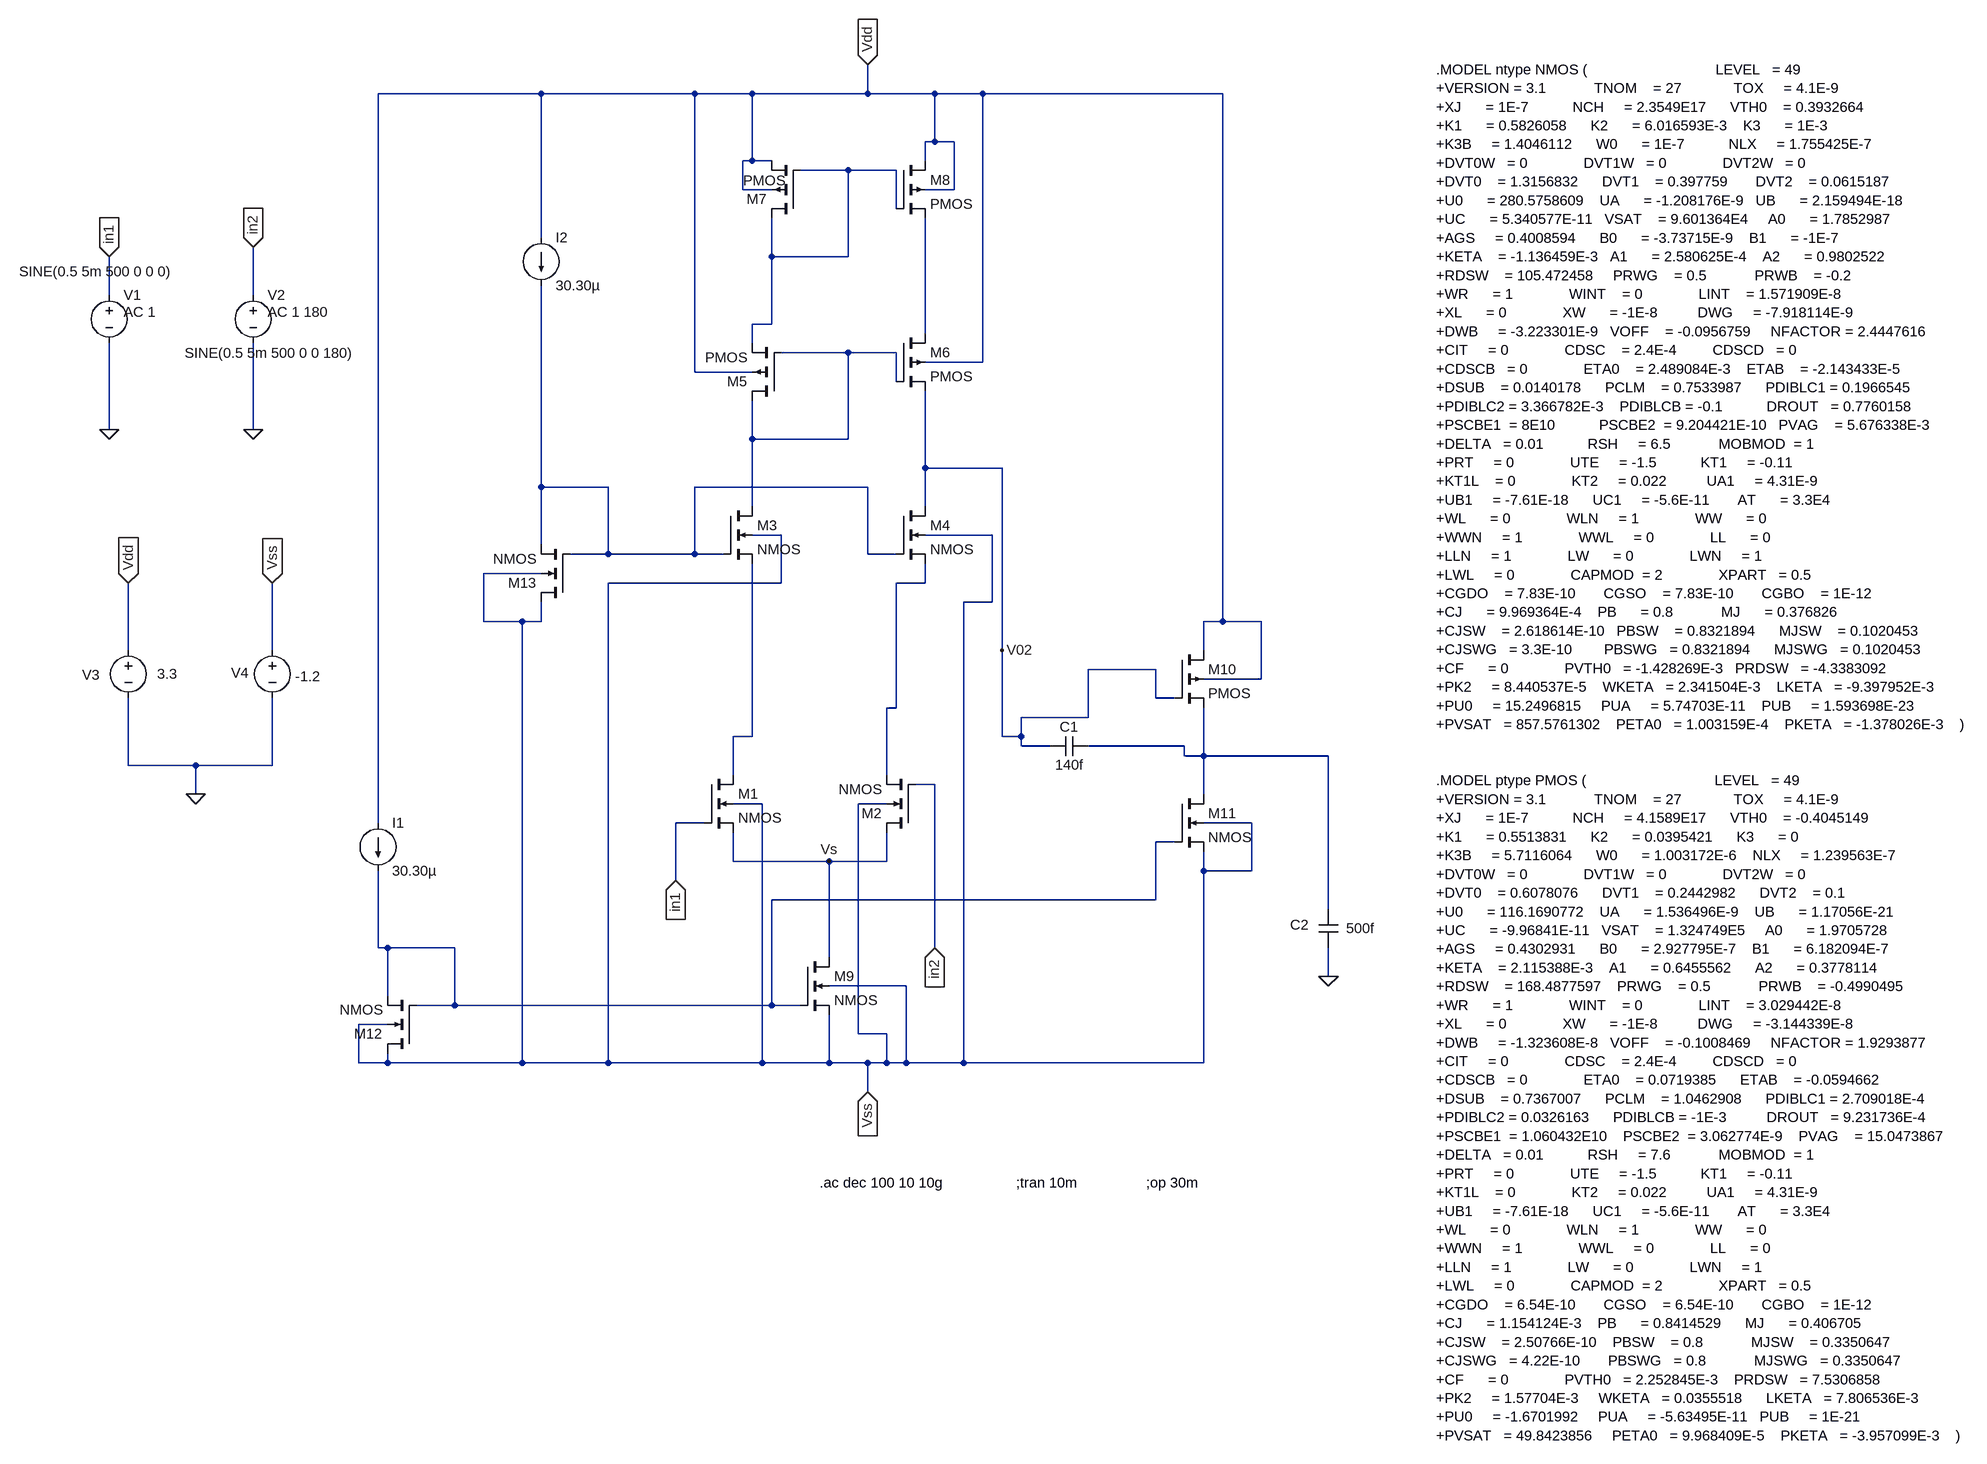
[diagram p0: schematic ##2 stage telescopic opamp (2).asc]
##2 stage telescopic opamp (2).asc, the LTspice schematic file:
Version 4
SHEET 1 2396 1624
WIRE -224 -672 -496 -672
WIRE 32 -672 -224 -672
WIRE 128 -672 32 -672
WIRE 320 -672 320 -720
WIRE 320 -672 128 -672
WIRE 432 -672 320 -672
WIRE 512 -672 432 -672
WIRE 912 -672 512 -672
WIRE 432 -592 432 -672
WIRE 432 -592 416 -592
WIRE 464 -592 432 -592
WIRE 128 -560 128 -672
WIRE 128 -560 112 -560
WIRE 160 -560 128 -560
WIRE 416 -560 416 -592
WIRE 288 -544 208 -544
WIRE 368 -544 288 -544
WIRE 112 -512 112 -560
WIRE 160 -512 112 -512
WIRE 464 -512 464 -592
WIRE 464 -512 416 -512
WIRE 368 -480 368 -544
WIRE -224 -432 -224 -672
WIRE 160 -400 160 -464
WIRE 288 -400 288 -544
WIRE 288 -400 160 -400
WIRE -944 -336 -944 -400
WIRE -704 -336 -704 -416
WIRE 160 -288 160 -400
WIRE 160 -288 128 -288
WIRE 416 -272 416 -464
WIRE 128 -256 128 -288
WIRE 288 -240 176 -240
WIRE 368 -240 288 -240
WIRE 512 -224 512 -672
WIRE 512 -224 416 -224
WIRE 32 -208 32 -672
WIRE 128 -208 32 -208
WIRE 368 -192 368 -240
WIRE -944 -112 -944 -256
WIRE -704 -112 -704 -256
WIRE 128 -96 128 -160
WIRE 288 -96 288 -240
WIRE 288 -96 128 -96
WIRE 416 -48 416 -176
WIRE 544 -48 416 -48
WIRE -224 -16 -224 -352
WIRE -112 -16 -224 -16
WIRE 320 -16 32 -16
WIRE 128 16 128 -96
WIRE 416 16 416 -48
WIRE 176 64 128 64
WIRE 528 64 416 64
WIRE -224 80 -224 -16
WIRE -112 96 -112 -16
WIRE -112 96 -176 96
WIRE 32 96 32 -16
WIRE 32 96 -112 96
WIRE 80 96 32 96
WIRE 320 96 320 -16
WIRE 368 96 320 96
WIRE -224 128 -320 128
WIRE 176 144 176 64
WIRE 176 144 -112 144
WIRE 416 144 416 112
WIRE 416 144 368 144
WIRE 528 176 528 64
WIRE 528 176 480 176
WIRE -320 208 -320 128
WIRE -256 208 -320 208
WIRE -224 208 -224 176
WIRE -224 208 -256 208
WIRE 912 208 912 -672
WIRE 912 208 880 208
WIRE 976 208 912 208
WIRE -912 256 -912 144
WIRE -672 256 -672 144
WIRE 544 256 544 -48
WIRE 880 256 880 208
WIRE 800 288 688 288
WIRE 976 304 976 208
WIRE 976 304 880 304
WIRE 800 336 800 288
WIRE 832 336 800 336
WIRE 368 352 368 144
WIRE 368 352 352 352
WIRE 688 368 688 288
WIRE 688 368 576 368
WIRE 128 400 128 112
WIRE 128 400 96 400
WIRE 544 400 544 256
WIRE 576 400 576 368
WIRE 576 400 544 400
WIRE 576 416 576 400
WIRE 624 416 576 416
WIRE 848 416 688 416
WIRE 848 432 848 416
WIRE 880 432 880 352
WIRE 880 432 848 432
WIRE 1088 432 880 432
WIRE -912 448 -912 336
WIRE -800 448 -912 448
WIRE -672 448 -672 336
WIRE -672 448 -800 448
WIRE 96 464 96 400
WIRE 352 464 352 352
WIRE 432 480 400 480
WIRE -800 496 -800 448
WIRE 880 496 880 432
WIRE 144 512 96 512
WIRE 352 512 304 512
WIRE -496 544 -496 -672
WIRE 48 544 0 544
WIRE 960 544 880 544
WIRE 832 576 800 576
WIRE 96 608 96 560
WIRE 256 608 96 608
WIRE 352 608 352 560
WIRE 352 608 256 608
WIRE 880 624 880 592
WIRE 960 624 960 544
WIRE 960 624 880 624
WIRE 0 640 0 544
WIRE 800 672 800 576
WIRE 800 672 160 672
WIRE 1088 688 1088 432
WIRE -496 752 -496 624
WIRE -480 752 -496 752
WIRE -368 752 -480 752
WIRE 432 752 432 480
WIRE 256 768 256 608
WIRE 1088 800 1088 752
WIRE 384 816 256 816
WIRE -480 832 -480 752
WIRE -368 848 -368 752
WIRE -368 848 -432 848
WIRE 160 848 160 672
WIRE 160 848 -368 848
WIRE 208 848 160 848
WIRE -480 880 -528 880
WIRE 304 896 304 512
WIRE 352 896 304 896
WIRE -528 944 -528 880
WIRE -480 944 -480 928
WIRE -480 944 -528 944
WIRE -256 944 -256 208
WIRE -256 944 -480 944
WIRE -112 944 -112 144
WIRE -112 944 -256 944
WIRE 144 944 144 512
WIRE 144 944 -112 944
WIRE 256 944 256 864
WIRE 256 944 144 944
WIRE 320 944 256 944
WIRE 352 944 352 896
WIRE 352 944 320 944
WIRE 384 944 384 816
WIRE 384 944 352 944
WIRE 480 944 480 176
WIRE 480 944 384 944
WIRE 880 944 880 624
WIRE 880 944 480 944
WIRE 320 992 320 944
FLAG 1088 800 0
FLAG -800 496 0
FLAG 256 608 Vs
FLAG -944 -112 0
FLAG -944 -400 in1
IOPIN -944 -400 In
FLAG 0 640 in1
IOPIN 0 640 In
FLAG 432 752 in2
IOPIN 432 752 In
FLAG -704 -112 0
FLAG -704 -416 in2
IOPIN -704 -416 In
FLAG 544 256 V02
FLAG -912 144 Vdd
IOPIN -912 144 In
FLAG -672 144 Vss
IOPIN -672 144 In
FLAG 320 -720 Vdd
IOPIN 320 -720 In
FLAG 320 992 Vss
IOPIN 320 992 In
SYMBOL nmos4 48 464 R0
SYMATTR InstName M1
SYMATTR Value2 l=180n w=0.745u
SYMBOL nmos4 208 768 R0
SYMATTR InstName M9
SYMATTR Value2 l=180n w=1490n
SYMBOL nmos4 -432 928 R180
SYMATTR InstName M12
SYMATTR Value2 l=180n w=50n
SYMBOL nmos4 400 560 R180
SYMATTR InstName M2
SYMATTR Value2 l=180n w=0.745u
SYMBOL nmos4 832 496 R0
SYMATTR InstName M11
SYMATTR Value2 l=180n w=10.2138u
SYMBOL pmos4 368 -560 R0
SYMATTR InstName M8
SYMATTR Value2 l=180n w=0.643u
SYMBOL pmos4 208 -464 R180
WINDOW 3 25 63 Left 2
SYMATTR InstName M7
SYMATTR Value2 l=180n w=0.643u
SYMBOL cap 688 400 R90
WINDOW 0 0 32 VBottom 2
WINDOW 3 32 32 VTop 2
SYMATTR InstName C1
SYMATTR Value 140f
SYMBOL cap 1104 752 R180
WINDOW 0 49 38 Left 2
WINDOW 3 -61 32 Left 2
SYMATTR InstName C2
SYMATTR Value 500f
SYMBOL pmos4 832 256 R0
SYMATTR InstName M10
SYMATTR Value2 l=180n w=16.248u
SYMBOL current -496 544 R0
WINDOW 123 0 0 Left 0
WINDOW 39 0 0 Left 0
SYMATTR InstName I1
SYMATTR Value 30.30µ
SYMBOL voltage -912 240 R0
WINDOW 123 0 0 Left 0
WINDOW 39 0 0 Left 0
WINDOW 0 -77 57 Left 2
WINDOW 3 48 56 Left 2
SYMATTR InstName V3
SYMATTR Value 3.3
SYMBOL voltage -672 240 R0
WINDOW 123 0 0 Left 0
WINDOW 39 0 0 Left 0
WINDOW 0 -69 54 Left 2
WINDOW 3 38 60 Left 2
SYMATTR InstName V4
SYMATTR Value -1.2
SYMBOL pmos4 176 -160 R180
SYMATTR InstName M5
SYMATTR Value2 l=180n w=0.643u
SYMBOL pmos4 368 -272 R0
SYMATTR InstName M6
SYMATTR Value2 l=180n w=0.643u
SYMBOL nmos4 80 16 R0
SYMATTR InstName M3
SYMATTR Value2 l=180n w=0.331u
SYMBOL nmos4 368 16 R0
SYMATTR InstName M4
SYMATTR Value2 l=180n w=0.331u
SYMBOL nmos4 -176 176 R180
SYMATTR InstName M13
SYMATTR Value2 l=180n w=116n
SYMBOL current -224 -432 R0
SYMATTR InstName I2
SYMATTR Value 30.30µ
SYMBOL voltage -944 -352 R0
WINDOW 3 -150 -23 Left 2
WINDOW 123 24 44 Left 2
WINDOW 39 0 0 Left 0
SYMATTR Value SINE(0.5 5m 500 0 0 0)
SYMATTR Value2 AC 1
SYMATTR InstName V1
SYMBOL voltage -704 -352 R0
WINDOW 3 -114 113 Left 2
WINDOW 123 24 44 Left 2
WINDOW 39 0 0 Left 0
SYMATTR Value SINE(0.5 5m 500 0 0 180)
SYMATTR Value2 AC 1 180
SYMATTR InstName V2
TEXT 1456 -712 Left 2 !.MODEL ntype NMOS (                                LEVEL   = 49\n+VERSION = 3.1            TNOM    = 27             TOX     = 4.1E-9\n+XJ      = 1E-7           NCH     = 2.3549E17      VTH0    = 0.3932664\n+K1      = 0.5826058      K2      = 6.016593E-3    K3      = 1E-3\n+K3B     = 1.4046112      W0      = 1E-7           NLX     = 1.755425E-7\n+DVT0W   = 0              DVT1W   = 0              DVT2W   = 0\n+DVT0    = 1.3156832      DVT1    = 0.397759       DVT2    = 0.0615187\n+U0      = 280.5758609    UA      = -1.208176E-9   UB      = 2.159494E-18\n+UC      = 5.340577E-11   VSAT    = 9.601364E4     A0      = 1.7852987\n+AGS     = 0.4008594      B0      = -3.73715E-9    B1      = -1E-7\n+KETA    = -1.136459E-3   A1      = 2.580625E-4    A2      = 0.9802522\n+RDSW    = 105.472458     PRWG    = 0.5            PRWB    = -0.2\n+WR      = 1              WINT    = 0              LINT    = 1.571909E-8\n+XL      = 0              XW      = -1E-8          DWG     = -7.918114E-9\n+DWB     = -3.223301E-9   VOFF    = -0.0956759     NFACTOR = 2.4447616\n+CIT     = 0              CDSC    = 2.4E-4         CDSCD   = 0\n+CDSCB   = 0              ETA0    = 2.489084E-3    ETAB    = -2.143433E-5\n+DSUB    = 0.0140178      PCLM    = 0.7533987      PDIBLC1 = 0.1966545\n+PDIBLC2 = 3.366782E-3    PDIBLCB = -0.1           DROUT   = 0.7760158\n+PSCBE1  = 8E10           PSCBE2  = 9.204421E-10   PVAG    = 5.676338E-3\n+DELTA   = 0.01           RSH     = 6.5            MOBMOD  = 1\n+PRT     = 0              UTE     = -1.5           KT1     = -0.11\n+KT1L    = 0              KT2     = 0.022          UA1     = 4.31E-9\n+UB1     = -7.61E-18      UC1     = -5.6E-11       AT      = 3.3E4\n+WL      = 0              WLN     = 1              WW      = 0\n+WWN     = 1              WWL     = 0              LL      = 0\n+LLN     = 1              LW      = 0              LWN     = 1\n+LWL     = 0              CAPMOD  = 2              XPART   = 0.5\n+CGDO    = 7.83E-10       CGSO    = 7.83E-10       CGBO    = 1E-12\n+CJ      = 9.969364E-4    PB      = 0.8            MJ      = 0.376826\n+CJSW    = 2.618614E-10   PBSW    = 0.8321894      MJSW    = 0.1020453\n+CJSWG   = 3.3E-10        PBSWG   = 0.8321894      MJSWG   = 0.1020453\n+CF      = 0              PVTH0   = -1.428269E-3   PRDSW   = -4.3383092\n+PK2     = 8.440537E-5    WKETA   = 2.341504E-3    LKETA   = -9.397952E-3\n+PU0     = 15.2496815     PUA     = 5.74703E-11    PUB     = 1.593698E-23\n+PVSAT   = 857.5761302    PETA0   = 1.003159E-4    PKETA   = -1.378026E-3    )\n \n\n.MODEL ptype PMOS (                                LEVEL   = 49\n+VERSION = 3.1            TNOM    = 27             TOX     = 4.1E-9\n+XJ      = 1E-7           NCH     = 4.1589E17      VTH0    = -0.4045149\n+K1      = 0.5513831      K2      = 0.0395421      K3      = 0\n+K3B     = 5.7116064      W0      = 1.003172E-6    NLX     = 1.239563E-7\n+DVT0W   = 0              DVT1W   = 0              DVT2W   = 0\n+DVT0    = 0.6078076      DVT1    = 0.2442982      DVT2    = 0.1\n+U0      = 116.1690772    UA      = 1.536496E-9    UB      = 1.17056E-21\n+UC      = -9.96841E-11   VSAT    = 1.324749E5     A0      = 1.9705728\n+AGS     = 0.4302931      B0      = 2.927795E-7    B1      = 6.182094E-7\n+KETA    = 2.115388E-3    A1      = 0.6455562      A2      = 0.3778114\n+RDSW    = 168.4877597    PRWG    = 0.5            PRWB    = -0.4990495\n+WR      = 1              WINT    = 0              LINT    = 3.029442E-8\n+XL      = 0              XW      = -1E-8          DWG     = -3.144339E-8\n+DWB     = -1.323608E-8   VOFF    = -0.1008469     NFACTOR = 1.9293877\n+CIT     = 0              CDSC    = 2.4E-4         CDSCD   = 0\n+CDSCB   = 0              ETA0    = 0.0719385      ETAB    = -0.0594662\n+DSUB    = 0.7367007      PCLM    = 1.0462908      PDIBLC1 = 2.709018E-4\n+PDIBLC2 = 0.0326163      PDIBLCB = -1E-3          DROUT   = 9.231736E-4\n+PSCBE1  = 1.060432E10    PSCBE2  = 3.062774E-9    PVAG    = 15.0473867\n+DELTA   = 0.01           RSH     = 7.6            MOBMOD  = 1\n+PRT     = 0              UTE     = -1.5           KT1     = -0.11\n+KT1L    = 0              KT2     = 0.022          UA1     = 4.31E-9\n+UB1     = -7.61E-18      UC1     = -5.6E-11       AT      = 3.3E4\n+WL      = 0              WLN     = 1              WW      = 0\n+WWN     = 1              WWL     = 0              LL      = 0\n+LLN     = 1              LW      = 0              LWN     = 1\n+LWL     = 0              CAPMOD  = 2              XPART   = 0.5\n+CGDO    = 6.54E-10       CGSO    = 6.54E-10       CGBO    = 1E-12\n+CJ      = 1.154124E-3    PB      = 0.8414529      MJ      = 0.406705\n+CJSW    = 2.50766E-10    PBSW    = 0.8            MJSW    = 0.3350647\n+CJSWG   = 4.22E-10       PBSWG   = 0.8            MJSWG   = 0.3350647\n+CF      = 0              PVTH0   = 2.252845E-3    PRDSW   = 7.5306858\n+PK2     = 1.57704E-3     WKETA   = 0.0355518      LKETA   = 7.806536E-3\n+PU0     = -1.6701992     PUA     = -5.63495E-11   PUB     = 1E-21\n+PVSAT   = 49.8423856     PETA0   = 9.968409E-5    PKETA   = -3.957099E-3    )
TEXT 240 1144 Left 2 !.ac dec 100 10 10g
TEXT 568 1144 Left 2 !;tran 10m
TEXT 784 1144 Left 2 !;op 30m

The netlist it stands for:
* ##2 stage telescopic opamp (2).asc
M1 N006 in1 Vs Vss NMOS l=180n w=0.745u
M9 Vs N008 Vss Vss NMOS l=180n w=1490n
M12 Vss N008 N008 Vss NMOS l=180n w=50n
M2 Vs in2 N005 Vss NMOS l=180n w=0.745u
M11 N007 N008 Vss Vss NMOS l=180n w=10.2138u
M8 Vdd N001 N002 Vdd PMOS l=180n w=0.643u
M7 N001 N001 Vdd Vdd PMOS l=180n w=0.643u
C1 N007 V02 140f
C2 0 N007 500f
M10 Vdd V02 N007 Vdd PMOS l=180n w=16.248u
I1 Vdd N008 30.30µ
V3 Vdd 0 3.3
V4 Vss 0 -1.2
M5 N003 N003 N001 Vdd PMOS l=180n w=0.643u
M6 N002 N003 V02 Vdd PMOS l=180n w=0.643u
M3 N003 N004 N006 Vss NMOS l=180n w=0.331u
M4 V02 N004 N005 Vss NMOS l=180n w=0.331u
M13 Vss N004 N004 Vss NMOS l=180n w=116n
I2 Vdd N004 30.30µ
V1 in1 0 SINE(0.5 5m 500 0 0 0) AC 1
V2 in2 0 SINE(0.5 5m 500 0 0 180) AC 1 180
.model NMOS NMOS
.model PMOS PMOS
.lib standard.mos
.MODEL ntype NMOS (                                LEVEL   = 49
+VERSION = 3.1            TNOM    = 27             TOX     = 4.1E-9
+XJ      = 1E-7           NCH     = 2.3549E17      VTH0    = 0.3932664
+K1      = 0.5826058      K2      = 6.016593E-3    K3      = 1E-3
+K3B     = 1.4046112      W0      = 1E-7           NLX     = 1.755425E-7
+DVT0W   = 0              DVT1W   = 0              DVT2W   = 0
+DVT0    = 1.3156832      DVT1    = 0.397759       DVT2    = 0.0615187
+U0      = 280.5758609    UA      = -1.208176E-9   UB      = 2.159494E-18
+UC      = 5.340577E-11   VSAT    = 9.601364E4     A0      = 1.7852987
+AGS     = 0.4008594      B0      = -3.73715E-9    B1      = -1E-7
+KETA    = -1.136459E-3   A1      = 2.580625E-4    A2      = 0.9802522
+RDSW    = 105.472458     PRWG    = 0.5            PRWB    = -0.2
+WR      = 1              WINT    = 0              LINT    = 1.571909E-8
+XL      = 0              XW      = -1E-8          DWG     = -7.918114E-9
+DWB     = -3.223301E-9   VOFF    = -0.0956759     NFACTOR = 2.4447616
+CIT     = 0              CDSC    = 2.4E-4         CDSCD   = 0
+CDSCB   = 0              ETA0    = 2.489084E-3    ETAB    = -2.143433E-5
+DSUB    = 0.0140178      PCLM    = 0.7533987      PDIBLC1 = 0.1966545
+PDIBLC2 = 3.366782E-3    PDIBLCB = -0.1           DROUT   = 0.7760158
+PSCBE1  = 8E10           PSCBE2  = 9.204421E-10   PVAG    = 5.676338E-3
+DELTA   = 0.01           RSH     = 6.5            MOBMOD  = 1
+PRT     = 0              UTE     = -1.5           KT1     = -0.11
+KT1L    = 0              KT2     = 0.022          UA1     = 4.31E-9
+UB1     = -7.61E-18      UC1     = -5.6E-11       AT      = 3.3E4
+WL      = 0              WLN     = 1              WW      = 0
+WWN     = 1              WWL     = 0              LL      = 0
+LLN     = 1              LW      = 0              LWN     = 1
+LWL     = 0              CAPMOD  = 2              XPART   = 0.5
+CGDO    = 7.83E-10       CGSO    = 7.83E-10       CGBO    = 1E-12
+CJ      = 9.969364E-4    PB      = 0.8            MJ      = 0.376826
+CJSW    = 2.618614E-10   PBSW    = 0.8321894      MJSW    = 0.1020453
+CJSWG   = 3.3E-10        PBSWG   = 0.8321894      MJSWG   = 0.1020453
+CF      = 0              PVTH0   = -1.428269E-3   PRDSW   = -4.3383092
+PK2     = 8.440537E-5    WKETA   = 2.341504E-3    LKETA   = -9.397952E-3
+PU0     = 15.2496815     PUA     = 5.74703E-11    PUB     = 1.593698E-23
+PVSAT   = 857.5761302    PETA0   = 1.003159E-4    PKETA   = -1.378026E-3    )
.MODEL ptype PMOS (                                LEVEL   = 49
+VERSION = 3.1            TNOM    = 27             TOX     = 4.1E-9
+XJ      = 1E-7           NCH     = 4.1589E17      VTH0    = -0.4045149
+K1      = 0.5513831      K2      = 0.0395421      K3      = 0
+K3B     = 5.7116064      W0      = 1.003172E-6    NLX     = 1.239563E-7
+DVT0W   = 0              DVT1W   = 0              DVT2W   = 0
+DVT0    = 0.6078076      DVT1    = 0.2442982      DVT2    = 0.1
+U0      = 116.1690772    UA      = 1.536496E-9    UB      = 1.17056E-21
+UC      = -9.96841E-11   VSAT    = 1.324749E5     A0      = 1.9705728
+AGS     = 0.4302931      B0      = 2.927795E-7    B1      = 6.182094E-7
+KETA    = 2.115388E-3    A1      = 0.6455562      A2      = 0.3778114
+RDSW    = 168.4877597    PRWG    = 0.5            PRWB    = -0.4990495
+WR      = 1              WINT    = 0              LINT    = 3.029442E-8
+XL      = 0              XW      = -1E-8          DWG     = -3.144339E-8
+DWB     = -1.323608E-8   VOFF    = -0.1008469     NFACTOR = 1.9293877
+CIT     = 0              CDSC    = 2.4E-4         CDSCD   = 0
+CDSCB   = 0              ETA0    = 0.0719385      ETAB    = -0.0594662
+DSUB    = 0.7367007      PCLM    = 1.0462908      PDIBLC1 = 2.709018E-4
+PDIBLC2 = 0.0326163      PDIBLCB = -1E-3          DROUT   = 9.231736E-4
+PSCBE1  = 1.060432E10    PSCBE2  = 3.062774E-9    PVAG    = 15.0473867
+DELTA   = 0.01           RSH     = 7.6            MOBMOD  = 1
+PRT     = 0              UTE     = -1.5           KT1     = -0.11
+KT1L    = 0              KT2     = 0.022          UA1     = 4.31E-9
+UB1     = -7.61E-18      UC1     = -5.6E-11       AT      = 3.3E4
+WL      = 0              WLN     = 1              WW      = 0
+WWN     = 1              WWL     = 0              LL      = 0
+LLN     = 1              LW      = 0              LWN     = 1
+LWL     = 0              CAPMOD  = 2              XPART   = 0.5
+CGDO    = 6.54E-10       CGSO    = 6.54E-10       CGBO    = 1E-12
+CJ      = 1.154124E-3    PB      = 0.8414529      MJ      = 0.406705
+CJSW    = 2.50766E-10    PBSW    = 0.8            MJSW    = 0.3350647
+CJSWG   = 4.22E-10       PBSWG   = 0.8            MJSWG   = 0.3350647
+CF      = 0              PVTH0   = 2.252845E-3    PRDSW   = 7.5306858
+PK2     = 1.57704E-3     WKETA   = 0.0355518      LKETA   = 7.806536E-3
+PU0     = -1.6701992     PUA     = -5.63495E-11   PUB     = 1E-21
+PVSAT   = 49.8423856     PETA0   = 9.968409E-5    PKETA   = -3.957099E-3    )
.ac dec 100 10 10g
;tran 10m
;op 30m
.backanno
.end